# Altium schematic sheet ArduinoUno.SchDoc
size 209 x 148 mm; Organization: LieBtrau
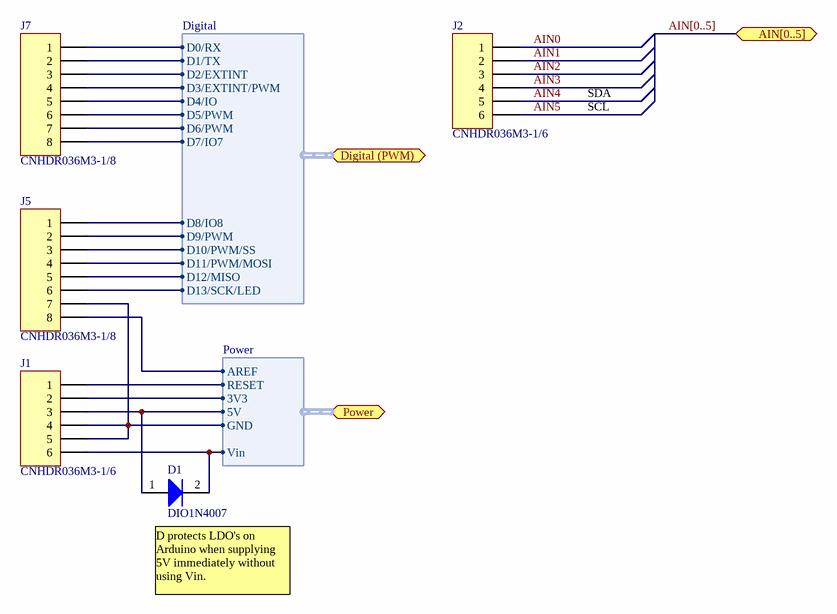
[diagram p0: ArduinoUno.SchDoc]

## Parts
D1  DIO1N4007  [DO-41]
J1  CNHDR036M3-1/6  [J_HDR1X6]
J2  CNHDR036M3-1/6  [J_HDR1X6]
J5  CNHDR036M3-1/8  [J_HDR1X8]
J7  CNHDR036M3-1/8  [J_HDR1X8]

## Ports
AIN[0..5], Digital (PWM) (harness Digital), Power (harness Power)

## Harnesses
Power: RESET, 3V3, 5V, GND, Vin, AREF
Digital: D0/RX, D1/TX, D2/EXTINT, D3/EXTINT/PWM, D4/IO, D5/PWM, D6/PWM, D7/IO7, D9/PWM, D10/PWM/SS, D11/PWM/MOSI, D12/MISO, D13/SCK/LED, D8/IO8

## Nets
AIN0: J2.1
AIN1: J2.2
AIN2: J2.3
AIN3: J2.4
AIN4: J2.5
AIN5: J2.6
NetD1_1: D1.1(A) J1.3 ; port Power.5V
NetD1_2: D1.2(K) J1.6 ; port Power.Vin
NetJ1_1: J1.1 ; port Power.RESET
NetJ1_2: J1.2 ; port Power.3V3
NetJ1_4: J1.4 J1.5 J5.7 ; port Power.GND
NetJ5_1: J5.1 ; port Digital (PWM).D8/IO8
NetJ5_2: J5.2 ; port Digital (PWM).D9/PWM
NetJ5_3: J5.3 ; port Digital (PWM).D10/PWM/SS
NetJ5_4: J5.4 ; port Digital (PWM).D11/PWM/MOSI
NetJ5_5: J5.5 ; port Digital (PWM).D12/MISO
NetJ5_6: J5.6 ; port Digital (PWM).D13/SCK/LED
NetJ5_8: J5.8 ; port Power.AREF
NetJ7_1: J7.1 ; port Digital (PWM).D0/RX
NetJ7_2: J7.2 ; port Digital (PWM).D1/TX
NetJ7_3: J7.3 ; port Digital (PWM).D2/EXTINT
NetJ7_4: J7.4 ; port Digital (PWM).D3/EXTINT/PWM
NetJ7_5: J7.5 ; port Digital (PWM).D4/IO
NetJ7_6: J7.6 ; port Digital (PWM).D5/PWM
NetJ7_7: J7.7 ; port Digital (PWM).D6/PWM
NetJ7_8: J7.8 ; port Digital (PWM).D7/IO7

## Buses and harness runs
bus AIN[0..5] = port AIN[0..5]

## Notes on the sheet
- SDA
- SCL
- (near D1) D protects LDO's on Arduino when supplying 5V immediately without using Vin.
- Title:
- Doc. Name:
- Variant:
- PCB Nr.:
- Rev.:
- Date:
- Drawn by:
- Sheet:
- of

## Library data of the parts
D1 = DIO1N4007: 1 Amp General Purpose Rectifier; Part Number: DIO1N4007
J1 J2 = CNHDR036M3-1/6: *; Order Code: RS: 673-7474; Part Number: CNHDR036M3-1/6
J5 J7 = CNHDR036M3-1/8: *; Order Code: RS: 673-7483; Part Number: CNHDR036M3-1/8